# Altium schematic sheet pinout_v1.SchDoc
size A
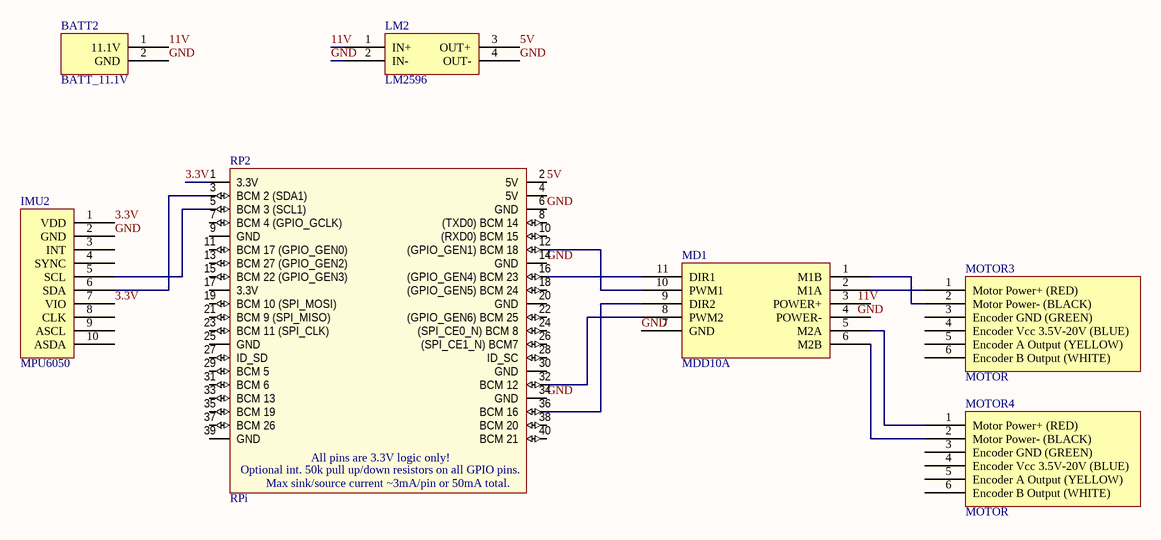
[diagram p0: pinout_v1.SchDoc]

## Parts
BATT2  BATT_11.1V
IMU2  MPU6050
LM2  LM2596
MD1  MDD10A
MOTOR3  MOTOR
MOTOR4  MOTOR
RP2  RPi  [40-Pin IDC Connector 2.54mm Pitch]

## Nets
3.3V: IMU2.1(VDD) IMU2.7(VIO) RP2.1(3.3V)
5V: LM2.3(OUT+) RP2.2(5V)
11V: BATT2.1(11.1V) LM2.1(IN+) MD1.3(POWER+)
GND: BATT2.2(GND) IMU2.2(GND) LM2.2(IN-) LM2.4(OUT-) MD1.4(POWER-) MD1.7(GND) RP2.6(GND) RP2.14(GND) RP2.34(GND)
NetIMU2_5: IMU2.5(SCL) RP2.5(BCM_3_(SCL1))
NetIMU2_6: IMU2.6(SDA) RP2.3(BCM_2_(SDA1))
NetMD1_1: MD1.1(M1B) MOTOR3.2(Motor_Power-_(BLACK))
NetMD1_2: MD1.2(M1A) MOTOR3.1(Motor_Power+_(RED))
NetMD1_5: MD1.5(M2A) MOTOR4.1(Motor_Power+_(RED))
NetMD1_6: MD1.6(M2B) MOTOR4.2(Motor_Power-_(BLACK))
NetMD1_8: MD1.8(PWM2) RP2.32(BCM_12)
NetMD1_9: MD1.9(DIR2) RP2.36(BCM_16)
NetMD1_10: MD1.10(PWM1) RP2.12((GPIO_GEN1)_BCM_18)
NetMD1_11: MD1.11(DIR1) RP2.16((GPIO_GEN4)_BCM_23)

Not connected (* = marked no-connect by the designer): IMU2 3(INT) 4(SYNC) 8(CLK) 9(ASCL) 10(ASDA); MOTOR3 3(Encoder_GND_(GREEN)) 4(Encoder_Vcc_3.5V-20V_(BLUE)) 5(Encoder_A_Output_(YELLOW)) 6(Encoder_B_Output_(WHITE)); MOTOR4 3(Encoder_GND_(GREEN)) 4(Encoder_Vcc_3.5V-20V_(BLUE)) 5(Encoder_A_Output_(YELLOW)) 6(Encoder_B_Output_(WHITE)); RP2 4(5V) 7(BCM_4_(GPIO_GCLK)) 8((TXD0)_BCM_14) 9(GND) 10((RXD0)_BCM_15) 11(BCM_17_(GPIO_GEN0)) 13(BCM_27_(GPIO_GEN2)) 15(BCM_22_(GPIO_GEN3)) 17(3.3V) 18((GPIO_GEN5)_BCM_24) 19(BCM_10_(SPI_MOSI)) 20(GND) 21(BCM_9_(SPI_MISO)) 22((GPIO_GEN6)_BCM_25) 23(BCM_11_(SPI_CLK)) 24((SPI_CE0_N)_BCM_8) 25(GND) 26((SPI_CE1_N)_BCM7) 27(ID_SD) 28(ID_SC) 29(BCM_5) 30(GND) 31(BCM_6) 33(BCM_13) 35(BCM_19) 37(BCM_26) 38(BCM_20) 39(GND) 40(BCM_21)

## Notes on the sheet
- (in symbol RPi) All pins are 3.3V logic only!; Optional int. 50k pull up/down resistors on all GPIO pins.; Max sink/source current ~3mA/pin or 50mA total.

## Library data of the parts
BATT2 = BATT_11.1V: 11.1V, 4000mAh, 40C 3S LiPo Battery
IMU2 = MPU6050: SparkFun Triple Axis Accelerometer and Gyro Breakout
LM2 = LM2596: DZS Elec 2PCS LM2596 DC-DC Step Down Variable Volt Regulator Input 3.2V-40V Output 1.25V-35V Adjustable Buck Converter Electronic Voltage Stabilizer Power Supply Module
MD1 = MDD10A: Cytron 10A 5-30V Dual Channel DC Motor Driver
MOTOR3 MOTOR4 = MOTOR: 30:1 Metal Gearmotor 37Dx68L mm with 64 CPR Encoder
RP2 = RPi: 40-pin IDC 2.54mm P Header with RPi 2+ GPIO pinout; Connector Manufacturer: TE Connectivity; RPi GPIO Pinout: https://pinout.xyz/; Connector Datasheet: http://www.mouser.com/ds/2/418/NG_CD_1761603_B1-619330.pdf; Mouser Part #: 571-3-1761603-3; Adafruit Cable: https://www.adafruit.com/product/1988